# Altium schematic sheet Supply Switches 12V 3V3 1V8.SchDoc
size 420 x 297 mm; Author: ALTIUM GOSTBOM2.0 KEV; SheetNumber: 44; SheetTotal: 48
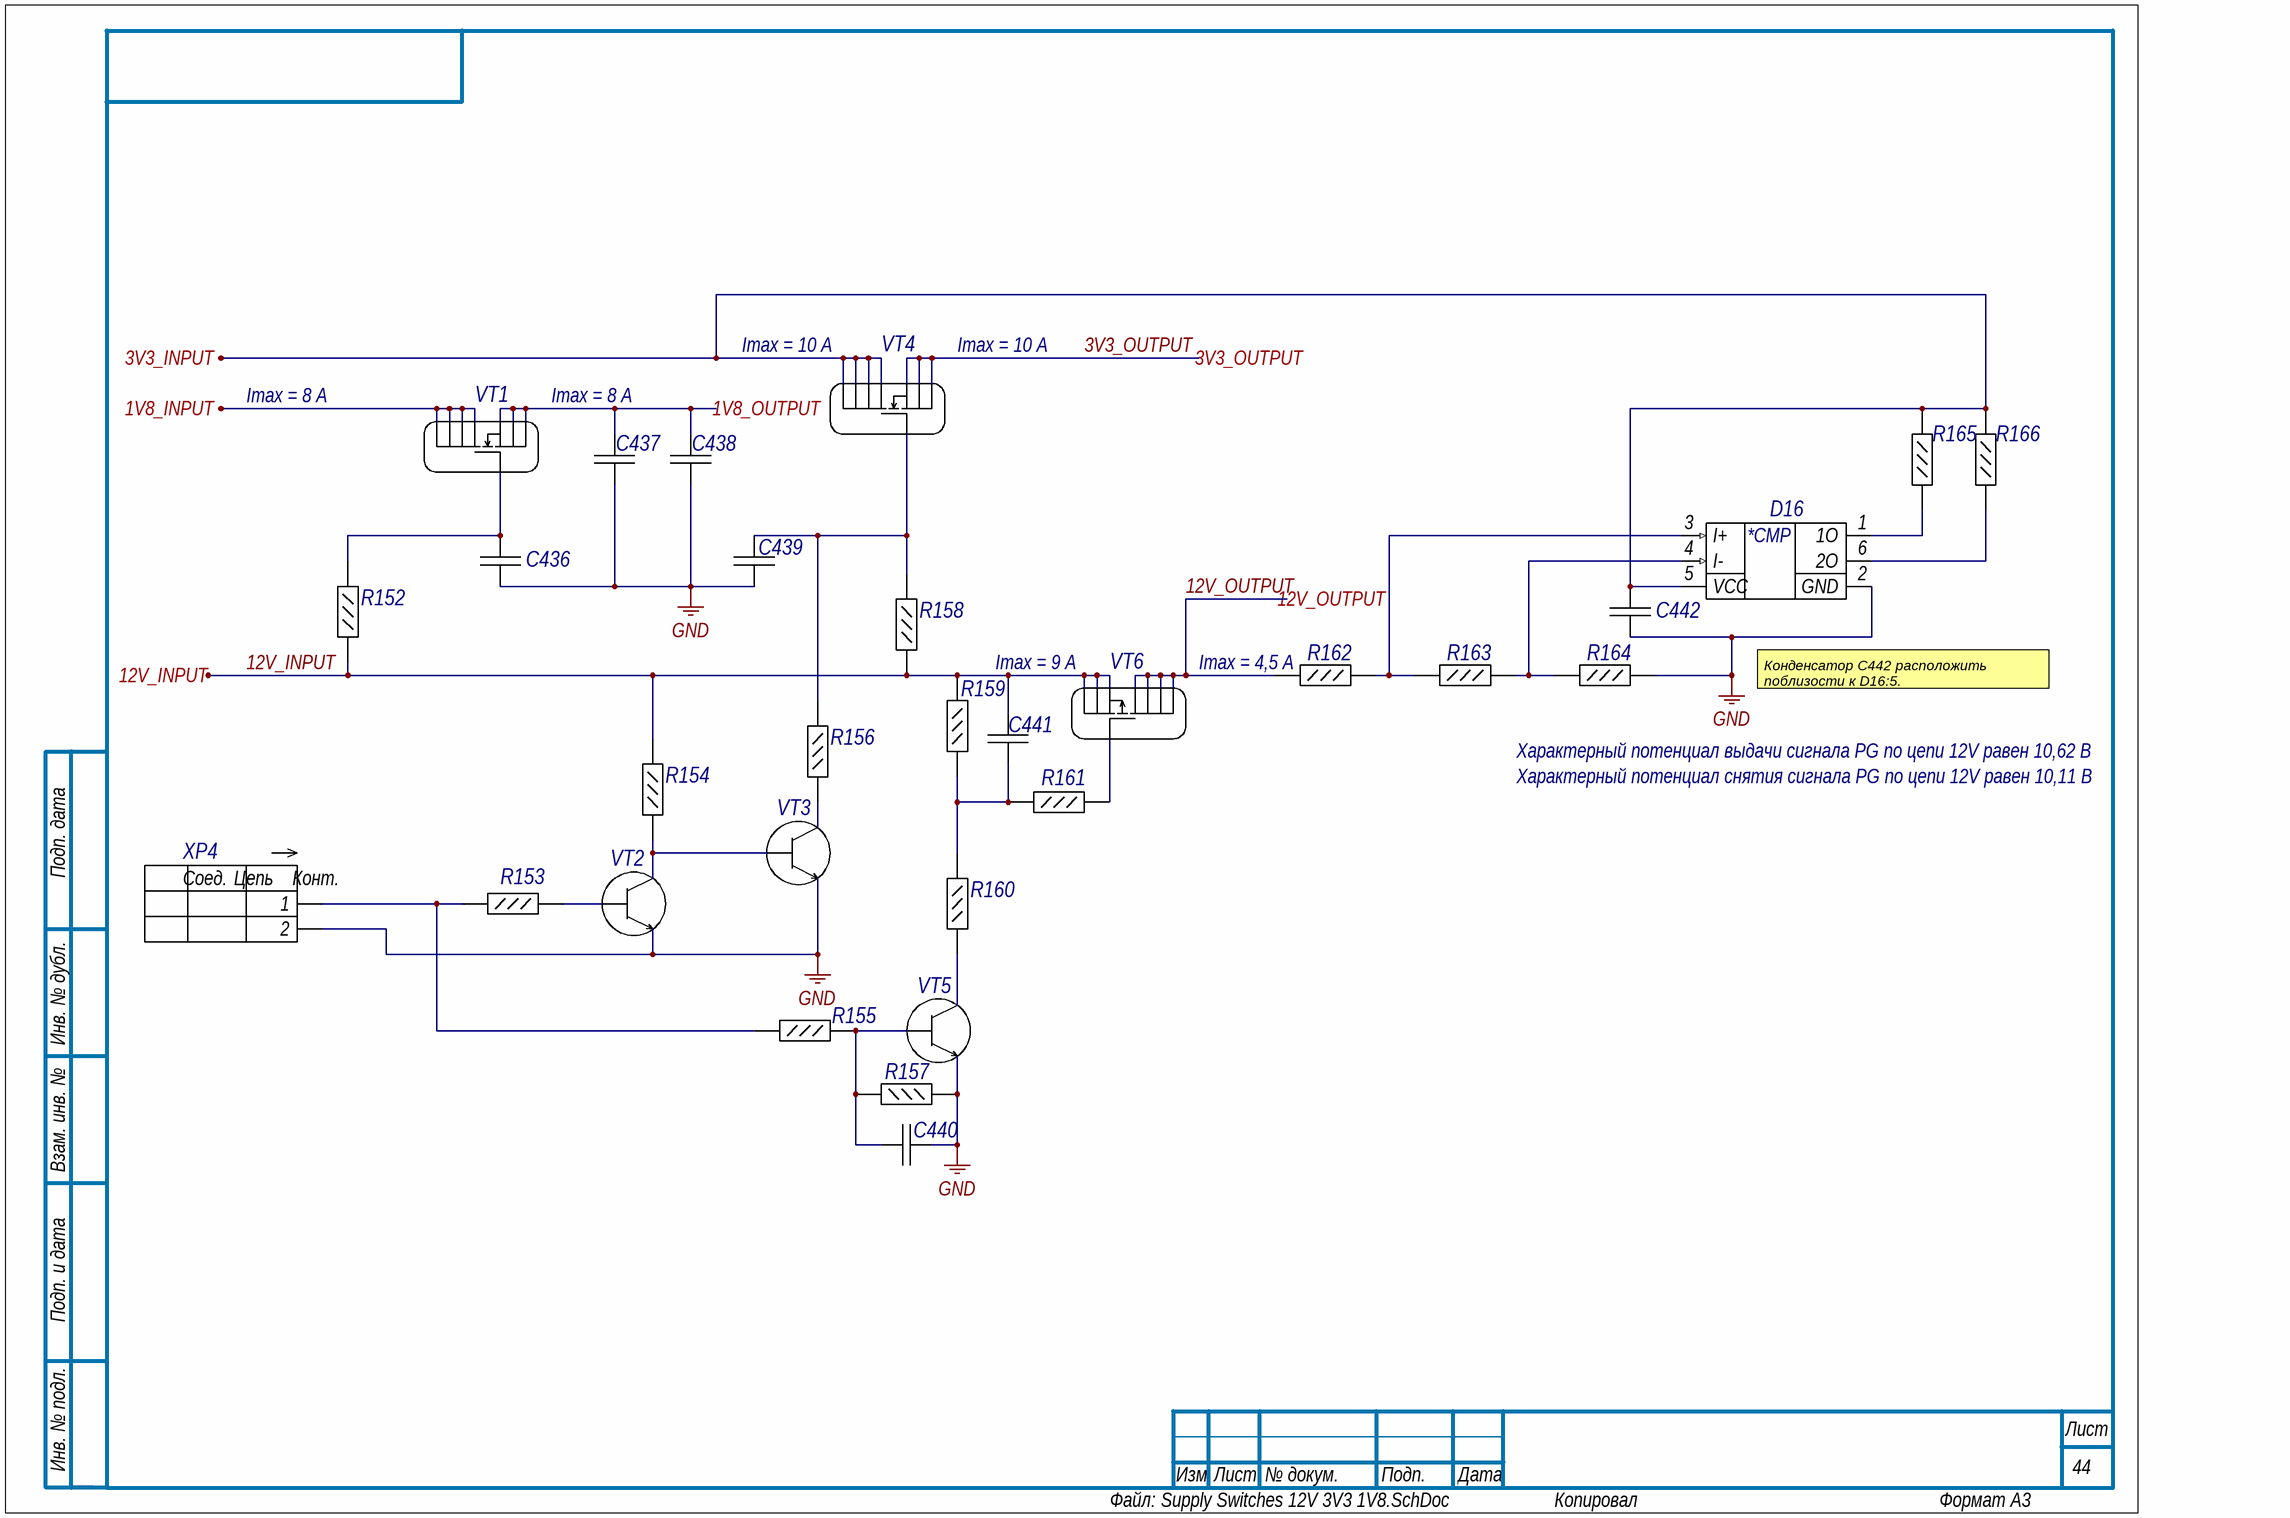
[diagram p0: Supply Switches 12V 3V3 1V8.SchDoc]

## Parts
C436  GRM155R71H103KA88D  [CAPC1005X55X25ML05T10]  (value not drawn)
C437  C3216X5R1A476M160AB  [CAPC3216X180X20ML20]  (value not drawn)
C438  C3216X5R1A476M160AB  [CAPC3216X180X20ML20]  (value not drawn)
C439  GRM155R71H103KA88D  [CAPC1005X55X25ML05T10]  (value not drawn)
C440  C1005X7R1E104M  [CAPC1005X55X10LL05]  (value not drawn)
C441  CGB2A1X5R1E105K033BC  [CAPC1005X33X10LL5]  (value not drawn)
C442  C1005X7R1E104M  [CAPC1005X55X10LL05]  (value not drawn)
D16  TPS3700DDCR  [DDC0006A_M]  (value not drawn)
R152  ERJ-2RKF1003X  [RESC1005X40X25LL05T05]  (value not drawn)
R153  ERJ-2RKF1002X  [RESC1005X40X25LL05T05]  (value not drawn)
R154  ERJ-2RKF1003X  [RESC1005X40X25LL05T05]  (value not drawn)
R155  ERJ-2RKF1002X  [RESC1005X40X25LL05T05]  (value not drawn)
R156  ERJ-2RKF1001X  [RESC1005X40X25LL05T05]  (value not drawn)
R157  ERJ-2RKF1002X  [RESC1005X40X25LL05T05]  (value not drawn)
R158  ERJ-2RKF1003X  [RESC1005X40X25LL05T05]  (value not drawn)
R159  ERJ-2RKF4992X  [RESC1005X40X25LL05T05]  (value not drawn)
R160  ERJ-2RKF1003X  [RESC1005X40X25LL05T05]  (value not drawn)
R161  ERJ-2RKF10R0X  [RESC1005X40X25LL05T05]  (value not drawn)
R162  ERJ-2RKF2552x  [RESC1005X40X25LL05T05]  (value not drawn)
R163  NRC04F49R9TRF  [RESC1005X35X25NL8T10]  (value not drawn)
R164  ERJ-2RKF1001X  [RESC1005X40X25LL05T05]  (value not drawn)
R165  ERJ-2RKF1002X  [RESC1005X40X25LL05T05]  (value not drawn)
R166  ERJ-2RKF1002X  [RESC1005X40X25LL05T05]  (value not drawn)
VT1  SiRA00DP-T1-GE3  [VISH-PPAKSO-8_V]  (value not drawn)
VT2  MMBT2222A-7-F  [DIOD-SOT23-3_V]  (value not drawn)
VT3  MMBT2222A-7-F  [DIOD-SOT23-3_V]  (value not drawn)
VT4  SiRA00DP-T1-GE3  [VISH-PPAKSO-8_V]  (value not drawn)
VT5  MMBT2222A-7-F  [DIOD-SOT23-3_V]  (value not drawn)
VT6  Si7635DP-T1-GE3  [VISH-PPAKSO-8_V]  (value not drawn)
XP4  613 002 111 21  [WE-61300211121_V]  (value not drawn)

## Ports
1V8_INPUT, 1V8_OUTPUT, 3V3_INPUT, 3V3_OUTPUT, 12V_INPUT, 12V_OUTPUT

## Nets
GND: C436.1 C437.1 C438.1 C439.1 C440.1 C442.1 D16.2(GND) R157.1 R164.1 VT2.2 VT3.2 VT5.2 XP4.2
1V8_INPUT: VT1.5(D) VT1.6(D) VT1.7(D) VT1.8(D) ; port 1V8_INPUT
1V8_OUTPUT: C437.2 C438.2 VT1.1(S) VT1.2(S) VT1.3(S) ; port 1V8_OUTPUT
3V3_INPUT: C442.2 D16.5(VCC) R165.1 R166.1 VT4.5(D) VT4.6(D) VT4.7(D) VT4.8(D) ; port 3V3_INPUT
3V3_OUTPUT: VT4.1(S) VT4.2(S) VT4.3(S) ; port 3V3_OUTPUT
12V_INPUT: C441.2 R152.2 R154.1 R158.2 R159.2 VT6.1(S) VT6.2(S) VT6.3(S) ; port 12V_INPUT
12V_OUTPUT: R162.2 VT6.5(D) VT6.6(D) VT6.7(D) VT6.8(D) ; port 12V_OUTPUT
NetC436_2: C436.2 R152.1 VT1.4(G)
NetC439_2: C439.2 R156.2 R158.1 VT4.4(G)
NetC440_2: C440.2 R155.1 R157.2 VT5.1
NetC441_1: C441.1 R159.1 R160.2 R161.1
NetD16_1: D16.1(1O) R165.2
NetD16_3: D16.3(I+) R162.1 R163.2
NetD16_4: D16.4(I-) R163.1 R164.2
NetD16_6: D16.6(2O) R166.2
NetR153_1: R153.1 VT2.1
NetR153_2: R153.2 R155.2 XP4.1
NetR154_2: R154.2 VT2.3 VT3.1
NetR156_1: R156.1 VT3.3
NetR160_1: R160.1 VT5.3
NetR161_2: R161.2 VT6.4(G)

## Notes on the sheet
- (near VT4) Imax = 10 А
- Imax = 10 А
- Imax = 8 А
- Imax = 9 А
- (near R162) Imax = 4,5 А
- Конденсатор C442 расположить поблизости к D16:5.
- Характерный потенциал выдачи сигнала PG по цепи 12V равен 10,62 В
- Характерный потенциал снятия сигнала PG по цепи 12V равен 10,11 В
- Подп. дата
- Инв. № дубл.
- Взам. инв. №
- Подп. и дата
- Инв. № подл.
- Изм.
- Лист
- № докум.
- Подп.
- Дата
- ALTIUM GOSTBOM2.0 KEV
- Файл:
- Копировал
- Формат А3
- (in symbol E32) Соед.; Цепь; Конт.
- (in symbol E109) *CMP

## Library data of the parts
C436 = E3: Chip Capacitor, 10 nF, +/- 10%, 50 V, -55 to 125 degC, 0402 (1005 Metric), RoHS, Tape and Reel; Manufacturer: Basic Passives; Тип элемента: Конденсатор; Capacitance: 10 nF; Case\/Package: 0402; Type (Capacitors): X7R; Voltage Rating: 50 V; Old_des: C70; New_des: C445; UID: E3; Component Kind: Standard; Case Code (Imperial): 0402; Case Code (Metric): 1005; ComponentLink1Description: Manufacturer URL; ComponentLink1URL: http://www.murata.com/; ComponentLink2Description: Datasheet; ComponentLink2URL: http://search.murata.co.jp/Ceramy/image/img/A01X/G101/ENG/GRM155R71H103KA88-01.pdf; DatasheetVersion: 02/2016; Length: 1 mm; Max Operating Temperature: 125 degC; Min Operating Temperature: -55 degC; Mounting Technology: Surface Mount; Package Quantity: 10000; PackageDescription: 2-Pin Surface Mount Device, Body 1 x 0.5 mm; Packaging: Tape and Reel; PartNumber: GRM155R71H103KA88D; RoHSCompliant: true; Tolerance: 10%; Width: 0.5 mm; Height: 0.5 mm; Lead Pitch: 2mm; Mount: Surface Mount; PackageReference: 0402; Pins: 2; Radiation Hardening: No; REACH SVHC: No SVHC; Voltage Rating (DC): 50 V
C437 = E6: Chip Capacitor, 47 uF, +/- 20%, 10 V, -55 to 85 degC, 1206 (3216 Metric), RoHS, Tape and Reel; Тип элемента: Конденсатор; Capacitance: 47 uF; Case\/Package: 1206; Type (Capacitors): X5R; Voltage Rating: 10 V; Old_des: C71; New_des: C446; UID: E6; Component Kind: Standard; Case Code (Imperial): 1206; Case Code (Metric): 3216; ComponentLink1Description: Manufacturer URL; ComponentLink1URL: http://www.tdk.com/; ComponentLink2Description: Datasheet; ComponentLink2URL: https://product.tdk.com/info/en/catalog/datasheets/mlcc_commercial_general_en.pdf; DatasheetVersion: 03/2015; Length: 3.2 mm; Max Operating Temperature: 85 degC; Min Operating Temperature: -55 degC; Mounting Technology: Surface Mount; Package Quantity: 2000; PackageDescription: 2-Pin Surface Mount Device, Body 3.2 x 1.6 mm; Packaging: Tape and Reel; RoHSCompliant: true; Tolerance: 20%; Width: 1.6 mm; Height: 1.6 mm; Mount: Surface Mount; PackageReference: 3216; Radiation Hardening: No; Voltage Rating (DC): 10 V
C438 = E6: Chip Capacitor, 47 uF, +/- 20%, 10 V, -55 to 85 degC, 1206 (3216 Metric), RoHS, Tape and Reel; Тип элемента: Конденсатор; Capacitance: 47 uF; Case\/Package: 1206; Type (Capacitors): X5R; Voltage Rating: 10 V; Old_des: C72; New_des: C447; UID: E6; Component Kind: Standard; Case Code (Imperial): 1206; Case Code (Metric): 3216; ComponentLink1Description: Manufacturer URL; ComponentLink1URL: http://www.tdk.com/; ComponentLink2Description: Datasheet; ComponentLink2URL: https://product.tdk.com/info/en/catalog/datasheets/mlcc_commercial_general_en.pdf; DatasheetVersion: 03/2015; Length: 3.2 mm; Max Operating Temperature: 85 degC; Min Operating Temperature: -55 degC; Mounting Technology: Surface Mount; Package Quantity: 2000; PackageDescription: 2-Pin Surface Mount Device, Body 3.2 x 1.6 mm; Packaging: Tape and Reel; RoHSCompliant: true; Tolerance: 20%; Width: 1.6 mm; Height: 1.6 mm; Mount: Surface Mount; PackageReference: 3216; Radiation Hardening: No; Voltage Rating (DC): 10 V
C439 = E3: Chip Capacitor, 10 nF, +/- 10%, 50 V, -55 to 125 degC, 0402 (1005 Metric), RoHS, Tape and Reel; Manufacturer: Basic Passives; Тип элемента: Конденсатор; Capacitance: 10 nF; Case\/Package: 0402; Type (Capacitors): X7R; Voltage Rating: 50 V; Old_des: C67; New_des: C448; UID: E3; Component Kind: Standard; Case Code (Imperial): 0402; Case Code (Metric): 1005; ComponentLink1Description: Manufacturer URL; ComponentLink1URL: http://www.murata.com/; ComponentLink2Description: Datasheet; ComponentLink2URL: http://search.murata.co.jp/Ceramy/image/img/A01X/G101/ENG/GRM155R71H103KA88-01.pdf; DatasheetVersion: 02/2016; Length: 1 mm; Max Operating Temperature: 125 degC; Min Operating Temperature: -55 degC; Mounting Technology: Surface Mount; Package Quantity: 10000; PackageDescription: 2-Pin Surface Mount Device, Body 1 x 0.5 mm; Packaging: Tape and Reel; PartNumber: GRM155R71H103KA88D; RoHSCompliant: true; Tolerance: 10%; Width: 0.5 mm; Height: 0.5 mm; Lead Pitch: 2mm; Mount: Surface Mount; PackageReference: 0402; Pins: 2; Radiation Hardening: No; REACH SVHC: No SVHC; Voltage Rating (DC): 50 V
C440 = E11: Chip Capacitor, 0.1 uF, +/- 20%, 25 V, -55 to 125 degC, 0402 (1005 Metric), RoHS, Tape and Reel; Тип элемента: Конденсатор; Capacitance: 100 nF; Case\/Package: 0402; Type (Capacitors): X7R; Voltage Rating: 25 V; Old_des: C68; New_des: C449; UID: E11; Component Kind: Standard; Case Code (Imperial): 0402; Case Code (Metric): 1005; ComponentLink1Description: Manufacturer URL; ComponentLink1URL: http://www.tdk.com/; ComponentLink2Description: Datasheet; ComponentLink2URL: http://www.farnell.com/datasheets/1571323.pdf; DatasheetVersion: 09/2011; Length: 1 mm; Max Operating Temperature: 125 degC; Min Operating Temperature: -55 degC; Mounting Technology: Surface Mount; Package Quantity: 10000; PackageDescription: 2-Pin Surface Mount Device, Body 1 x 0.5 mm; Packaging: Tape and Reel; PartNumber: C1005X7R1E104M; RoHSCompliant: true; Tolerance: 20%; Width: 0.5 mm; Height: 0.5 mm; Mount: Surface Mount; PackageReference: 0402; Pins: 2; Voltage Rating (DC): 25 V
C441 = E2: Chip Capacitor, 1 uF, +/- 10%, 25 V, -55 to 85 degC, 0402 (1005 Metric), RoHS, Tape and Reel; Тип элемента: Конденсатор; Capacitance: 1 uF; Old_des: C66; New_des: C450; UID: E2; Component Kind: Standard; Case Code (Imperial): 0402; Case Code (Metric): 1005; Case/Package: 0402; ComponentLink1Description: Manufacturer URL; ComponentLink1URL: http://www.tdk.com/; ComponentLink2Description: Datasheet; ComponentLink2URL: https://product.tdk.com/info/en/catalog/datasheets/mlcc_commercial_lowprofile_en.pdf; DatasheetVersion: 04/2015; Length: 0.039 inch; Max Operating Temperature: 85 degC; Min Operating Temperature: -55 degC; Mounting Technology: Surface Mount; Package Quantity: 1; PackageDescription: 2-Pin Surface Mount Device, Body 1 x 0.5 mm; Packaging: Tape and Reel; PartNumber: CGB2A1X5R1E105K033BC; RoHSCompliant: True; Tolerance: 10%; Width: 0.02 inch
C442 = E11: Chip Capacitor, 0.1 uF, +/- 20%, 25 V, -55 to 125 degC, 0402 (1005 Metric), RoHS, Tape and Reel; Тип элемента: Конденсатор; Capacitance: 100 nF; Case\/Package: 0402; Type (Capacitors): X7R; Voltage Rating: 25 V; Old_des: C69; New_des: C451; UID: E11; Component Kind: Standard; Case Code (Imperial): 0402; Case Code (Metric): 1005; ComponentLink1Description: Manufacturer URL; ComponentLink1URL: http://www.tdk.com/; ComponentLink2Description: Datasheet; ComponentLink2URL: http://www.farnell.com/datasheets/1571323.pdf; DatasheetVersion: 09/2011; Length: 1 mm; Max Operating Temperature: 125 degC; Min Operating Temperature: -55 degC; Mounting Technology: Surface Mount; Package Quantity: 10000; PackageDescription: 2-Pin Surface Mount Device, Body 1 x 0.5 mm; Packaging: Tape and Reel; PartNumber: C1005X7R1E104M; RoHSCompliant: true; Tolerance: 20%; Width: 0.5 mm; Height: 0.5 mm; Mount: Surface Mount; PackageReference: 0402; Pins: 2; Voltage Rating (DC): 25 V
D16 = E109: Window Comparator with Internal Reference for Overvoltage and Undervoltage Detection, 1.8 to 18 V, -40 to 125 degC, 6-Pin SOT (DDC), Green (RoHS & no Sb/Br), Tape and Reel; Тип элемента: Набор компараторов; Max Supply Voltage: 18 V; Min Supply Voltage: 1.8 V; Old_des: U9; New_des: D17; UID: E109; Component Kind: Standard; Case/Package: SOT-6; ComponentLink1Description: Manufacturer URL; ComponentLink1URL: http://www.ti.com/; ComponentLink2Description: Datasheet; ComponentLink2URL: http://www.ti.com/lit/ds/symlink/tps3700.pdf; DatasheetVersion: SBVS187D; Max Operating Temperature: 125 degC; Min Operating Temperature: -40 degC; Mounting Technology: Surface Mount; Package Quantity: 3000; PackageDescription: 6-Pin Small Outline Transistor, Body 2.9 x 1.6 mm, Pitch 0.95 mm; Packaging: Tape and Reel; PartNumber: TPS3700DDCR; RoHSCompliant: True; Mount: Surface Mount; Pins: 6; Code_JEDEC: MO-193; ComponentLink3Description: Package Specification; ComponentLink3URL: http://www.ti.com/litv/pdf/mpds124d; PackageVersion: 4204403-3/E, 06/2005
R152 = E58: Chip Resistor, 100 KOhm, +/- 1%, 100 mW, -55 to 155 degC, 0402 (1005 Metric), RoHS, Tape and Reel; Manufacturer: Basic Passives; Тип элемента: Резистор; Case\/Package: 0402; Voltage Rating: 50 V; Power Rating: 100 mW; Old_des: R125; New_des: R171; UID: E58; Component Kind: Standard; Case Code (Imperial): 0402; Case Code (Metric): 1005; ComponentLink1Description: Manufacturer URL; ComponentLink1URL: http://www.panasonic.com/; ComponentLink2Description: Datasheet; ComponentLink2URL: http://industrial.panasonic.com/cdbs/www-data/pdf/RDA0000/AOA0000C86.pdf; DatasheetVersion: 04/2015; Length: 1 mm; Max Operating Temperature: 155 degC; Min Operating Temperature: -55 degC; Mounting Technology: Surface Mount; Package Quantity: 10000; PackageDescription: 2-Pin Surface Mount Device, Body 1 x 0.5 mm; Packaging: Tape and Reel; PartNumber: ERJ-2RKF1003X; RoHSCompliant: true; Tolerance: 1%; Width: 0.5 mm; Height: 0.35 mm; Mount: Surface Mount; PackageReference: 0402; Pins: 2; Radiation Hardening: No; REACH SVHC: Yes; Resistance: 100 KOhm
R153 = E60: Chip Resistor, 10 KOhm, +/- 1%, 100 mW, -55 to 155 degC, 0402 (1005 Metric), RoHS, Tape and Reel; Manufacturer: Basic Passives; Тип элемента: Резистор; Case\/Package: 0402; Voltage Rating: 50 V; Power Rating: 100 mW; Resistance: 10 KOhm; Old_des: R127; New_des: R172; UID: E60; Component Kind: Standard; Case Code (Imperial): 0402; Case Code (Metric): 1005; ComponentLink1Description: Manufacturer URL; ComponentLink1URL: http://www.panasonic.com/; ComponentLink2Description: Datasheet; ComponentLink2URL: http://industrial.panasonic.com/cdbs/www-data/pdf/RDA0000/AOA0000C86.pdf; DatasheetVersion: 04/2015; Length: 1 mm; Max Operating Temperature: 155 degC; Min Operating Temperature: -55 degC; Mounting Technology: Surface Mount; Package Quantity: 10000; PackageDescription: 2-Pin Surface Mount Device, Body 1 x 0.5 mm; Packaging: Tape and Reel; PartNumber: ERJ-2RKF1002X; RoHSCompliant: true; Tolerance: 1%; Width: 0.5 mm; Height: 0.35 mm; Mount: Surface Mount; PackageReference: 0402; Pins: 2; Radiation Hardening: No; REACH SVHC: Yes
R154 = E58: Chip Resistor, 100 KOhm, +/- 1%, 100 mW, -55 to 155 degC, 0402 (1005 Metric), RoHS, Tape and Reel; Manufacturer: Basic Passives; Тип элемента: Резистор; Case\/Package: 0402; Voltage Rating: 50 V; Power Rating: 100 mW; Old_des: R124; New_des: R173; UID: E58; Component Kind: Standard; Case Code (Imperial): 0402; Case Code (Metric): 1005; ComponentLink1Description: Manufacturer URL; ComponentLink1URL: http://www.panasonic.com/; ComponentLink2Description: Datasheet; ComponentLink2URL: http://industrial.panasonic.com/cdbs/www-data/pdf/RDA0000/AOA0000C86.pdf; DatasheetVersion: 04/2015; Length: 1 mm; Max Operating Temperature: 155 degC; Min Operating Temperature: -55 degC; Mounting Technology: Surface Mount; Package Quantity: 10000; PackageDescription: 2-Pin Surface Mount Device, Body 1 x 0.5 mm; Packaging: Tape and Reel; PartNumber: ERJ-2RKF1003X; RoHSCompliant: true; Tolerance: 1%; Width: 0.5 mm; Height: 0.35 mm; Mount: Surface Mount; PackageReference: 0402; Pins: 2; Radiation Hardening: No; REACH SVHC: Yes; Resistance: 100 KOhm
R155 = E60: Chip Resistor, 10 KOhm, +/- 1%, 100 mW, -55 to 155 degC, 0402 (1005 Metric), RoHS, Tape and Reel; Manufacturer: Basic Passives; Тип элемента: Резистор; Case\/Package: 0402; Voltage Rating: 50 V; Power Rating: 100 mW; Resistance: 10 KOhm; Old_des: R118; New_des: R174; UID: E60; Component Kind: Standard; Case Code (Imperial): 0402; Case Code (Metric): 1005; ComponentLink1Description: Manufacturer URL; ComponentLink1URL: http://www.panasonic.com/; ComponentLink2Description: Datasheet; ComponentLink2URL: http://industrial.panasonic.com/cdbs/www-data/pdf/RDA0000/AOA0000C86.pdf; DatasheetVersion: 04/2015; Length: 1 mm; Max Operating Temperature: 155 degC; Min Operating Temperature: -55 degC; Mounting Technology: Surface Mount; Package Quantity: 10000; PackageDescription: 2-Pin Surface Mount Device, Body 1 x 0.5 mm; Packaging: Tape and Reel; PartNumber: ERJ-2RKF1002X; RoHSCompliant: true; Tolerance: 1%; Width: 0.5 mm; Height: 0.35 mm; Mount: Surface Mount; PackageReference: 0402; Pins: 2; Radiation Hardening: No; REACH SVHC: Yes
R156 = E59: Chip Resistor, 1 KOhm, +/- 1%, 100 mW, -55 to 155 degC, 0402 (1005 Metric), RoHS, Tape and Reel; Manufacturer: Basic Passives; Тип элемента: Резистор; Case\/Package: 0402; Voltage Rating: 50 V; Power Rating: 100 mW; Resistance: 1 KOhm; Old_des: R117; New_des: R175; UID: E59; Component Kind: Standard; Case Code (Imperial): 0402; Case Code (Metric): 1005; ComponentLink1Description: Manufacturer URL; ComponentLink1URL: http://www.panasonic.com/; ComponentLink2Description: Datasheet; ComponentLink2URL: http://industrial.panasonic.com/cdbs/www-data/pdf/RDA0000/AOA0000C86.pdf; DatasheetVersion: 04/2015; Length: 1 mm; Max Operating Temperature: 155 degC; Min Operating Temperature: -55 degC; Mounting Technology: Surface Mount; Package Quantity: 10000; PackageDescription: 2-Pin Surface Mount Device, Body 1 x 0.5 mm; Packaging: Tape and Reel; PartNumber: ERJ-2RKF1001X; RoHSCompliant: true; Tolerance: 1%; Width: 0.5 mm; Height: 0.35 mm; Mount: Surface Mount; PackageReference: 0402; Pins: 2; Radiation Hardening: No; REACH SVHC: Yes
R157 = E60: Chip Resistor, 10 KOhm, +/- 1%, 100 mW, -55 to 155 degC, 0402 (1005 Metric), RoHS, Tape and Reel; Manufacturer: Basic Passives; Тип элемента: Резистор; Case\/Package: 0402; Voltage Rating: 50 V; Power Rating: 100 mW; Resistance: 10 KOhm; Old_des: R119; New_des: R176; UID: E60; Component Kind: Standard; Case Code (Imperial): 0402; Case Code (Metric): 1005; ComponentLink1Description: Manufacturer URL; ComponentLink1URL: http://www.panasonic.com/; ComponentLink2Description: Datasheet; ComponentLink2URL: http://industrial.panasonic.com/cdbs/www-data/pdf/RDA0000/AOA0000C86.pdf; DatasheetVersion: 04/2015; Length: 1 mm; Max Operating Temperature: 155 degC; Min Operating Temperature: -55 degC; Mounting Technology: Surface Mount; Package Quantity: 10000; PackageDescription: 2-Pin Surface Mount Device, Body 1 x 0.5 mm; Packaging: Tape and Reel; PartNumber: ERJ-2RKF1002X; RoHSCompliant: true; Tolerance: 1%; Width: 0.5 mm; Height: 0.35 mm; Mount: Surface Mount; PackageReference: 0402; Pins: 2; Radiation Hardening: No; REACH SVHC: Yes
R158 = E58: Chip Resistor, 100 KOhm, +/- 1%, 100 mW, -55 to 155 degC, 0402 (1005 Metric), RoHS, Tape and Reel; Manufacturer: Basic Passives; Тип элемента: Резистор; Case\/Package: 0402; Voltage Rating: 50 V; Power Rating: 100 mW; Old_des: R115; New_des: R177; UID: E58; Component Kind: Standard; Case Code (Imperial): 0402; Case Code (Metric): 1005; ComponentLink1Description: Manufacturer URL; ComponentLink1URL: http://www.panasonic.com/; ComponentLink2Description: Datasheet; ComponentLink2URL: http://industrial.panasonic.com/cdbs/www-data/pdf/RDA0000/AOA0000C86.pdf; DatasheetVersion: 04/2015; Length: 1 mm; Max Operating Temperature: 155 degC; Min Operating Temperature: -55 degC; Mounting Technology: Surface Mount; Package Quantity: 10000; PackageDescription: 2-Pin Surface Mount Device, Body 1 x 0.5 mm; Packaging: Tape and Reel; PartNumber: ERJ-2RKF1003X; RoHSCompliant: true; Tolerance: 1%; Width: 0.5 mm; Height: 0.35 mm; Mount: Surface Mount; PackageReference: 0402; Pins: 2; Radiation Hardening: No; REACH SVHC: Yes; Resistance: 100 KOhm
R159 = E57: Chip Resistor, 49.9 KOhm, +/- 1%, 100 mW, -55 to 155 degC, 0402 (1005 Metric), RoHS, Tape and Reel; Manufacturer: Basic Passives; Тип элемента: Резистор; Case\/Package: 0402; Voltage Rating: 50 V; Power Rating: 100 mW; Old_des: R112; New_des: R178; UID: E57; Component Kind: Standard; Case Code (Imperial): 0402; Case Code (Metric): 1005; ComponentLink1Description: Manufacturer URL; ComponentLink1URL: http://www.panasonic.com/; ComponentLink2Description: Datasheet; ComponentLink2URL: http://industrial.panasonic.com/cdbs/www-data/pdf/RDA0000/AOA0000C86.pdf; DatasheetVersion: 04/2015; Length: 1 mm; Max Operating Temperature: 155 degC; Min Operating Temperature: -55 degC; Mounting Technology: Surface Mount; Package Quantity: 10000; PackageDescription: 2-Pin Surface Mount Device, Body 1 x 0.5 mm; Packaging: Tape and Reel; PartNumber: ERJ-2RKF4992X; RoHSCompliant: true; Tolerance: 1%; Width: 0.5 mm; Height: 0.35 mm; Mount: Surface Mount; PackageReference: 0402; Pins: 2; Radiation Hardening: No; REACH SVHC: No SVHC; Resistance: 49.9 KOhm
R160 = E58: Chip Resistor, 100 KOhm, +/- 1%, 100 mW, -55 to 155 degC, 0402 (1005 Metric), RoHS, Tape and Reel; Manufacturer: Basic Passives; Тип элемента: Резистор; Case\/Package: 0402; Voltage Rating: 50 V; Power Rating: 100 mW; Old_des: R116; New_des: R179; UID: E58; Component Kind: Standard; Case Code (Imperial): 0402; Case Code (Metric): 1005; ComponentLink1Description: Manufacturer URL; ComponentLink1URL: http://www.panasonic.com/; ComponentLink2Description: Datasheet; ComponentLink2URL: http://industrial.panasonic.com/cdbs/www-data/pdf/RDA0000/AOA0000C86.pdf; DatasheetVersion: 04/2015; Length: 1 mm; Max Operating Temperature: 155 degC; Min Operating Temperature: -55 degC; Mounting Technology: Surface Mount; Package Quantity: 10000; PackageDescription: 2-Pin Surface Mount Device, Body 1 x 0.5 mm; Packaging: Tape and Reel; PartNumber: ERJ-2RKF1003X; RoHSCompliant: true; Tolerance: 1%; Width: 0.5 mm; Height: 0.35 mm; Mount: Surface Mount; PackageReference: 0402; Pins: 2; Radiation Hardening: No; REACH SVHC: Yes; Resistance: 100 KOhm
R161 = E56: Chip Resistor, 10 Ohm, +/- 1%, 100 mW, -55 to 155 degC, 0402 (1005 Metric), RoHS, Tape and Reel; Manufacturer: Basic Passives; Тип элемента: Резистор; Case\/Package: 0402; Voltage Rating: 50 V; Power Rating: 100 mW; Resistance: 10 Ohm; Old_des: R114; New_des: R180; UID: E56; Component Kind: Standard; Case Code (Imperial): 0402; Case Code (Metric): 1005; ComponentLink1Description: Manufacturer URL; ComponentLink1URL: http://www.panasonic.com/; ComponentLink2Description: Datasheet; ComponentLink2URL: http://industrial.panasonic.com/cdbs/www-data/pdf/RDA0000/AOA0000C86.pdf; DatasheetVersion: 04/2015; Length: 1 mm; Max Operating Temperature: 155 degC; Min Operating Temperature: -55 degC; Mounting Technology: Surface Mount; Package Quantity: 10000; PackageDescription: 2-Pin Surface Mount Device, Body 1 x 0.5 mm; Packaging: Tape and Reel; PartNumber: ERJ-2RKF10R0X; RoHSCompliant: true; Tolerance: 1%; Width: 0.5 mm; Height: 0.35 mm; Mount: Surface Mount; PackageReference: 0402; Pins: 2; Radiation Hardening: No; REACH SVHC: Yes
R162 = E84: Chip Resistor, 25.5 KOhm, +/- 1%, 100 mW, -55 to 155 degC, 0402 (1005 Metric), RoHS, Tape and Reel; Тип элемента: Резистор; Voltage Rating: 50 V; Power Rating: 100 mW; Old_des: R113; New_des: R181; UID: E84; Component Kind: Standard; Case Code (Imperial): 0402; Case Code (Metric): 1005; Case/Package: 0402; ComponentLink1Description: Manufacturer URL; ComponentLink1URL: http://www.panasonic.com/; ComponentLink2Description: Datasheet; ComponentLink2URL: http://industrial.panasonic.com/cdbs/www-data/pdf/RDA0000/AOA0000C86.pdf; Length: 1 mm; Max Operating Temperature: 155 degC; Min Operating Temperature: -55 degC; Mounting Technology: Surface Mount; Package Quantity: 1; PackageDescription: 2-Pin Surface Mount Device, Body 1 x 0.5 mm; Packaging: Tape and Reel; PartNumber: ERJ-2RKF2552x; RoHSCompliant: True; Tolerance: 1%; Width: 0.5 mm; Height: 0.35 mm; Mount: Surface Mount; REACH SVHC: Yes; Resistance: 25.5 KOhm
R163 = E67: Chip Resistor, 49.9 Ohm, +/- 1%, 0.06 W, -55 to 155 degC, 0402 (1005 Metric), RoHS, Tape and Reel; Тип элемента: Резистор; Old_des: R120; New_des: R182; UID: E67; Component Kind: Standard; Case/Package: 0402; ComponentLink1Description: Manufacturer URL; ComponentLink1URL: http://www.niccomp.com/; ComponentLink2Description: Datasheet; ComponentLink2URL: https://datasheet.ciiva.com/27056/2008575-27056094.pdf; DatasheetVersion: 11/2008; Length: 1 mm; Max Operating Temperature: 155 degC; Min Operating Temperature: -55 degC; Mounting Technology: Surface Mount; PackageDescription: 2-Pin Surface Mount Device, Body 1 x 0.5 mm; Packaging: Tape and Reel; PartNumber: NRC04F49R9TRF; RoHSCompliant: True; Tolerance: 1%; Height: 0.3 mm; Radiation Hardening: No; Resistance: 49.9 Ohm
R164 = E59: Chip Resistor, 1 KOhm, +/- 1%, 100 mW, -55 to 155 degC, 0402 (1005 Metric), RoHS, Tape and Reel; Manufacturer: Basic Passives; Тип элемента: Резистор; Case\/Package: 0402; Voltage Rating: 50 V; Power Rating: 100 mW; Resistance: 1 KOhm; Old_des: R121; New_des: R183; UID: E59; Component Kind: Standard; Case Code (Imperial): 0402; Case Code (Metric): 1005; ComponentLink1Description: Manufacturer URL; ComponentLink1URL: http://www.panasonic.com/; ComponentLink2Description: Datasheet; ComponentLink2URL: http://industrial.panasonic.com/cdbs/www-data/pdf/RDA0000/AOA0000C86.pdf; DatasheetVersion: 04/2015; Length: 1 mm; Max Operating Temperature: 155 degC; Min Operating Temperature: -55 degC; Mounting Technology: Surface Mount; Package Quantity: 10000; PackageDescription: 2-Pin Surface Mount Device, Body 1 x 0.5 mm; Packaging: Tape and Reel; PartNumber: ERJ-2RKF1001X; RoHSCompliant: true; Tolerance: 1%; Width: 0.5 mm; Height: 0.35 mm; Mount: Surface Mount; PackageReference: 0402; Pins: 2; Radiation Hardening: No; REACH SVHC: Yes
R165 = E60: Chip Resistor, 10 KOhm, +/- 1%, 100 mW, -55 to 155 degC, 0402 (1005 Metric), RoHS, Tape and Reel; Manufacturer: Basic Passives; Тип элемента: Резистор; Case\/Package: 0402; Voltage Rating: 50 V; Power Rating: 100 mW; Resistance: 10 KOhm; Old_des: R122; New_des: R184; UID: E60; Component Kind: Standard; Case Code (Imperial): 0402; Case Code (Metric): 1005; ComponentLink1Description: Manufacturer URL; ComponentLink1URL: http://www.panasonic.com/; ComponentLink2Description: Datasheet; ComponentLink2URL: http://industrial.panasonic.com/cdbs/www-data/pdf/RDA0000/AOA0000C86.pdf; DatasheetVersion: 04/2015; Length: 1 mm; Max Operating Temperature: 155 degC; Min Operating Temperature: -55 degC; Mounting Technology: Surface Mount; Package Quantity: 10000; PackageDescription: 2-Pin Surface Mount Device, Body 1 x 0.5 mm; Packaging: Tape and Reel; PartNumber: ERJ-2RKF1002X; RoHSCompliant: true; Tolerance: 1%; Width: 0.5 mm; Height: 0.35 mm; Mount: Surface Mount; PackageReference: 0402; Pins: 2; Radiation Hardening: No; REACH SVHC: Yes
R166 = E60: Chip Resistor, 10 KOhm, +/- 1%, 100 mW, -55 to 155 degC, 0402 (1005 Metric), RoHS, Tape and Reel; Manufacturer: Basic Passives; Тип элемента: Резистор; Case\/Package: 0402; Voltage Rating: 50 V; Power Rating: 100 mW; Resistance: 10 KOhm; Old_des: R123; New_des: R185; UID: E60; Component Kind: Standard; Case Code (Imperial): 0402; Case Code (Metric): 1005; ComponentLink1Description: Manufacturer URL; ComponentLink1URL: http://www.panasonic.com/; ComponentLink2Description: Datasheet; ComponentLink2URL: http://industrial.panasonic.com/cdbs/www-data/pdf/RDA0000/AOA0000C86.pdf; DatasheetVersion: 04/2015; Length: 1 mm; Max Operating Temperature: 155 degC; Min Operating Temperature: -55 degC; Mounting Technology: Surface Mount; Package Quantity: 10000; PackageDescription: 2-Pin Surface Mount Device, Body 1 x 0.5 mm; Packaging: Tape and Reel; PartNumber: ERJ-2RKF1002X; RoHSCompliant: true; Tolerance: 1%; Width: 0.5 mm; Height: 0.35 mm; Mount: Surface Mount; PackageReference: 0402; Pins: 2; Radiation Hardening: No; REACH SVHC: Yes
VT1 = E52: N-Channe MOSFET, 30 V, -55 to 150 degC, 8-Pin SMD (PPAKSO-8), RoHS, Tape and Reel; Тип элемента: МДП-транзистор, индуцированный N канал; Old_des: Q17; New_des: VT1; UID: E52; Component Kind: Standard; Case/Package: SOIC; ComponentLink1Description: Manufacturer URL; ComponentLink1URL: http://www.vishay.com/; ComponentLink2Description: Datasheet; ComponentLink2URL: http://www.vishay.com/docs/63780/sira00dp.pdf; DatasheetVersion: Rev. B; Length: 5.99 mm; Max Operating Temperature: 150 degC; Min Operating Temperature: -55 degC; Mounting Technology: Surface Mount; Package Quantity: 1; PackageDescription: 8-Pin Surface Mount Device, Body 4.9 x 5.89 mm, Pitch 1.27 mm; Packaging: Tape and Reel; PartNumber: SiRA00DP-T1-GE3; RoHSCompliant: True; Width: 5 mm; Height: 1.07 mm; Mount: Surface Mount; Pins: 8; Radiation Hardening: No; REACH SVHC: Unknown
VT2 = E53: NPN Small Signal Transistor, 40 V, -55 to 150 degC, 3-Pin SOT23, RoHS, Tape and Reel; Manufacturer: Diodes Inc; Тип элемента: NPN-транзистор; Old_des: Q19; New_des: VT2; UID: E53; Component Kind: Standard; ComponentLink1Description: Manufacturer URL; ComponentLink1URL: http://www.diodes.com/; ComponentLink2Description: Datasheet; ComponentLink2URL: http://www.diodes.com/_files/datasheets/ds30041.pdf; DatasheetVersion: Rev. 16 - 2; Mounting Technology: Surface Mount; PackageDescription: 3-Pin Small Outline Transistor, Body 2.9 x 1.3 mm, Pitch 0.95 mm; PartNumber: MMBT2222A-7-F; PackageReference: SOT23-3
VT3 = E53: NPN Small Signal Transistor, 40 V, -55 to 150 degC, 3-Pin SOT23, RoHS, Tape and Reel; Manufacturer: Diodes Inc; Тип элемента: NPN-транзистор; Old_des: Q15; New_des: VT3; UID: E53; Component Kind: Standard; ComponentLink1Description: Manufacturer URL; ComponentLink1URL: http://www.diodes.com/; ComponentLink2Description: Datasheet; ComponentLink2URL: http://www.diodes.com/_files/datasheets/ds30041.pdf; DatasheetVersion: Rev. 16 - 2; Mounting Technology: Surface Mount; PackageDescription: 3-Pin Small Outline Transistor, Body 2.9 x 1.3 mm, Pitch 0.95 mm; PartNumber: MMBT2222A-7-F; PackageReference: SOT23-3
VT4 = E52: N-Channe MOSFET, 30 V, -55 to 150 degC, 8-Pin SMD (PPAKSO-8), RoHS, Tape and Reel; Тип элемента: МДП-транзистор, индуцированный N канал; Old_des: Q14; New_des: VT4; UID: E52; Component Kind: Standard; Case/Package: SOIC; ComponentLink1Description: Manufacturer URL; ComponentLink1URL: http://www.vishay.com/; ComponentLink2Description: Datasheet; ComponentLink2URL: http://www.vishay.com/docs/63780/sira00dp.pdf; DatasheetVersion: Rev. B; Length: 5.99 mm; Max Operating Temperature: 150 degC; Min Operating Temperature: -55 degC; Mounting Technology: Surface Mount; Package Quantity: 1; PackageDescription: 8-Pin Surface Mount Device, Body 4.9 x 5.89 mm, Pitch 1.27 mm; Packaging: Tape and Reel; PartNumber: SiRA00DP-T1-GE3; RoHSCompliant: True; Width: 5 mm; Height: 1.07 mm; Mount: Surface Mount; Pins: 8; Radiation Hardening: No; REACH SVHC: Unknown
VT5 = E53: NPN Small Signal Transistor, 40 V, -55 to 150 degC, 3-Pin SOT23, RoHS, Tape and Reel; Manufacturer: Diodes Inc; Тип элемента: NPN-транзистор; Old_des: Q16; New_des: VT5; UID: E53; Component Kind: Standard; ComponentLink1Description: Manufacturer URL; ComponentLink1URL: http://www.diodes.com/; ComponentLink2Description: Datasheet; ComponentLink2URL: http://www.diodes.com/_files/datasheets/ds30041.pdf; DatasheetVersion: Rev. 16 - 2; Mounting Technology: Surface Mount; PackageDescription: 3-Pin Small Outline Transistor, Body 2.9 x 1.3 mm, Pitch 0.95 mm; PartNumber: MMBT2222A-7-F; PackageReference: SOT23-3
VT6 = E54: P-Channel MOSFET, 20 V, -55 to 150 degC, 8-Pin SMD (PPAKSO-8), RoHS, Tape and Reel; Тип элемента: МДП-транзистор, индуцированный P канал; Old_des: Q13; New_des: VT6; UID: E54; Component Kind: Standard; ComponentLink1Description: Manufacturer URL; ComponentLink1URL: http://www.vishay.com/; ComponentLink2Description: Datasheet; ComponentLink2URL: http://www.vishay.com/docs/65021/si7635dp.pdf; DatasheetVersion: Rev. B; Mounting Technology: Surface Mount; PackageDescription: 8-Pin Surface Mount Device, Body 4.9 x 5.89 mm, Pitch 1.27 mm; PartNumber: Si7635DP-T1-GE3
XP4 = E32: Male Header, Pitch 2.54 mm, 1 x 2 Position, Height 8.54 mm, Tail Length 3 mm, -40 to 105 degC, RoHS, Bulk; Manufacturer: Wuerth Elektronik; Тип элемента: Соединитель; Old_des: J3; New_des: XP5; UID: E32; Component Kind: Standard; ComponentLink1Description: Manufacturer URL; ComponentLink1URL: https://www.we-online.com/; ComponentLink2Description: Datasheet; ComponentLink2URL: http://katalog.we-online.de/em/datasheet/6130xx11121.pdf; DatasheetVersion: Rev. J; Mounting Technology: Through Hole; PackageDescription: Male Header, Pitch 2.54 mm, 1 x 2 Position, Height 8.54 mm, Tail Length 3 mm; PartNumber: 613 002 111 21; PackageReference: 61300211121